# EAGLE schematic pov (EAGLE 6.1)
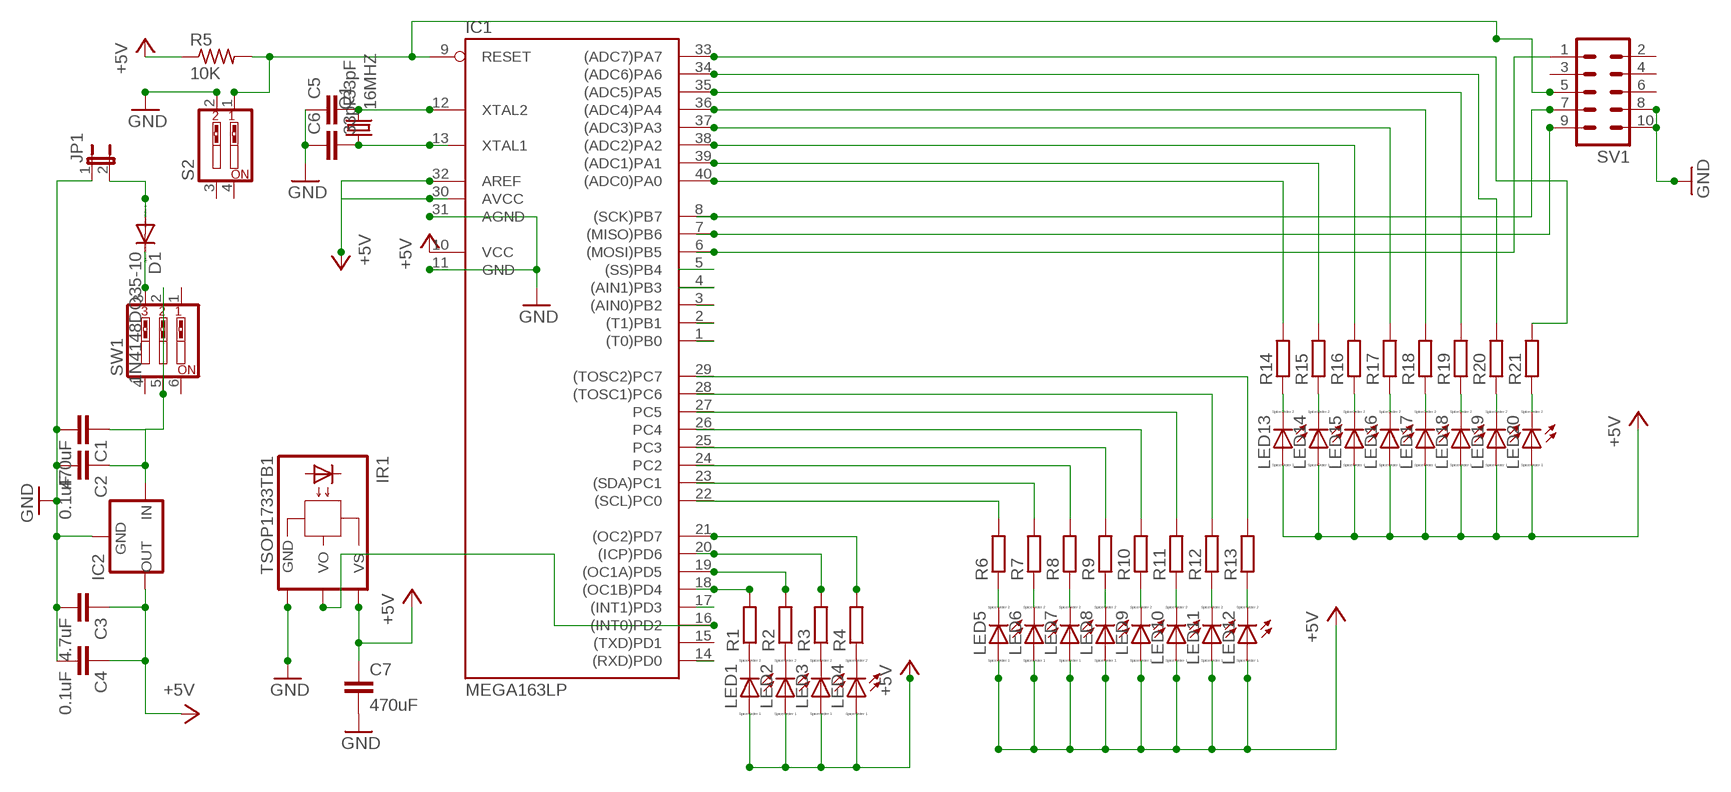
[diagram p0: schematic, sheet 1]

## Parts
C1  470uF  C2.5/4  [C2.5-4]
C2  0.1uF  C2.5/4  [C2.5-4]
C3  4.7uF  C2.5/4  [C2.5-4]
C4  0.1uF  C2.5/4  [C2.5-4]
C5  33pF  C2.5/4  [C2.5-4]
C6  33pF  C2.5/4  [C2.5-4]
C7  470uF  C2.5/4  [C2.5-4]
D1  1N4148DO35-10  [DO35-10]
IC1  MEGA163LP  [DIL40]
IC2  78XXS  [78XXS]
IR1  TSOP1733TB1  [TSOP17_TB1]
JP1  JP1E  [JP1]
LED1  LED_ELD260  [LED_LD260]
LED2  LED_ELD260  [LED_LD260]
LED3  LED_ELD260  [LED_LD260]
LED4  LED_ELD260  [LED_LD260]
LED5  LED_ELD260  [LED_LD260]
LED6  LED_ELD260  [LED_LD260]
LED7  LED_ELD260  [LED_LD260]
LED8  LED_ELD260  [LED_LD260]
LED9  LED_ELD260  [LED_LD260]
LED10  LED_ELD260  [LED_LD260]
LED11  LED_ELD260  [LED_LD260]
LED12  LED_ELD260  [LED_LD260]
LED13  LED_ELD260  [LED_LD260]
LED14  LED_ELD260  [LED_LD260]
LED15  LED_ELD260  [LED_LD260]
LED16  LED_ELD260  [LED_LD260]
LED17  LED_ELD260  [LED_LD260]
LED18  LED_ELD260  [LED_LD260]
LED19  LED_ELD260  [LED_LD260]
LED20  LED_ELD260  [LED_LD260]
Q1  16MHZ  CRYSTALHC49U-V  [HC49U-V]
R1  R-EU_0207/7  [0207/7]
R2  R-EU_0207/7  [0207/7]
R3  R-EU_0207/7  [0207/7]
R4  R-EU_0207/7  [0207/7]
R5  10K  R-US_0204/7  [0204/7]
R6  R-EU_0207/7  [0207/7]
R7  R-EU_0207/7  [0207/7]
R8  R-EU_0207/7  [0207/7]
R9  R-EU_0207/7  [0207/7]
R10  R-EU_0207/7  [0207/7]
R11  R-EU_0207/7  [0207/7]
R12  R-EU_0207/7  [0207/7]
R13  R-EU_0207/7  [0207/7]
R14  R-EU_0207/7  [0207/7]
R15  R-EU_0207/7  [0207/7]
R16  R-EU_0207/7  [0207/7]
R17  R-EU_0207/7  [0207/7]
R18  R-EU_0207/7  [0207/7]
R19  R-EU_0207/7  [0207/7]
R20  R-EU_0207/7  [0207/7]
R21  R-EU_0207/7  [0207/7]
S2  SW_DIP-2  [EDG-02]
SV1  MA05-2  [MA05-2]
SW1  SW_DIP-3  [EDG-03]

## Nets
+5V: C3.1 C4.1 C7.1 IC1.10(VCC) IC1.30(AVCC) IC1.32(AREF) IC2.OUT IR1.VS LED1.A LED2.A LED3.A LED4.A LED5.A LED6.A LED7.A LED8.A LED9.A LED10.A LED11.A LED12.A LED13.A LED14.A LED15.A LED16.A LED17.A LED18.A LED19.A LED20.A R5.1
GND: C1.2 C2.2 C3.2 C4.2 C5.1 C6.1 C7.2 IC1.11(GND) IC1.31(AGND) IC2.GND IR1.GND JP1.1 S2.2 SV1.8 SV1.10
N$1: D1.A JP1.2
N$2: LED12.K(C) R13.1
N$3: C5.2 IC1.12(XTAL2) Q1.2
N$4: C6.2 IC1.13(XTAL1) Q1.1
N$5: LED1.K(C) R1.1
N$6: IC1.9(RESET) R5.2 S2.1 SV1.5
N$7: IC1.22((SCL)PC0) R6.2
N$8: D1.C SW1.3
N$9: C1.1 C2.1 IC2.IN SW1.2 SW1.5
N$10: IC1.1((T0)PB0)
N$11: IC1.2((T1)PB1)
N$12: IC1.3((AIN0)PB2)
N$13: IC1.4((AIN1)PB3)
N$14: IC1.17((INT1)PD3)
N$16: IC1.5((SS)PB4)
N$17: IC1.28((TOSC1)PC6) R12.2
N$18: LED10.K(C) R11.1
N$19: IC1.26(PC4) R10.2
N$20: LED9.K(C) R10.1
N$21: IC1.25(PC3) R9.2
N$22: LED8.K(C) R9.1
N$23: LED7.K(C) R8.1
N$24: IC1.6((MOSI)PB5) SV1.1
N$25: IC1.7((MISO)PB6) SV1.9
N$26: IC1.8((SCK)PB7) SV1.7
N$27: IC1.14((RXD)PD0)
N$28: IC1.23((SDA)PC1) R7.2
N$29: IC1.33((ADC7)PA7) R21.2
N$30: IC1.34((ADC6)PA6) R20.2
N$31: IC1.35((ADC5)PA5) R19.2
N$32: IC1.36((ADC4)PA4) R18.2
N$33: IC1.37((ADC3)PA3) R17.2
N$34: IC1.38((ADC2)PA2) R16.2
N$35: IC1.39((ADC1)PA1) R15.2
N$36: IC1.40((ADC0)PA0) R14.2
N$37: IC1.24(PC2) R8.2
N$38: IC1.27(PC5) R11.2
N$39: IC1.29((TOSC2)PC7) R13.2
N$40: LED6.K(C) R7.1
N$41: LED20.K(C) R21.1
N$42: LED19.K(C) R20.1
N$43: LED18.K(C) R19.1
N$44: LED17.K(C) R18.1
N$45: LED15.K(C) R16.1
N$46: LED13.K(C) R14.1
N$47: LED16.K(C) R17.1
N$48: LED14.K(C) R15.1
N$49: LED5.K(C) R6.1
N$50: LED11.K(C) R12.1
N$51: LED2.K(C) R2.1
N$52: LED3.K(C) R3.1
N$53: LED4.K(C) R4.1
N$54: IC1.20((ICP)PD6) R3.2
N$55: IC1.21((OC2)PD7) R4.2
N$56: IC1.19((OC1A)PD5) R2.2
N$57: IC1.18((OC1B)PD4) R1.2
N$58: IC1.16((INT0)PD2) IR1.VO
Unconnected: IC1.15((TXD)PD1) S2.3 S2.4 SV1.2 SV1.3 SV1.4 SV1.6 SW1.1 SW1.4 SW1.6

## Library data of the parts
C1-C7 = capacitor-wima:C: CAPACITOR naming: grid - package width
D1 = diode:1N4148: DIODE high speed (Philips)
IC1 = atmel:MEGA163*P: MICROCONTROLLER 16 Kbytes FLASH 1 Kbytes EEPROM 1 Kbytes SRAM UART 8-channel 10 bit ADC hardware multiplier Source: avr.lbr; OC_FARNELL: unknown; OC_NEWARK: unknown
IC2 = v-reg:78XXS: VOLTAGE REGULATOR
IR1 = telefunken:TSOP17*TB1: TSOP17..TB1 IR Receiver Modules for Remote Control Systems Source: http://www.vishay.com/docs/82042/82042.pdf; OC_FARNELL: unknown; OC_NEWARK: unknown
JP1 = jumper:JP1E: JUMPER
LED1-LED20 = eagle-ltspice:LED_E: LED Source: http://www.osram.convergy.de Source: www.luxeon.com Source: www.kingbright.com; SPICEMODEL: NONE; SPICEPREFIX: D; SPICETYPE: diode
Q1 = crystal:CRYSTAL: CRYSTAL; OC_FARNELL: 1666969; OC_NEWARK: unknown
R1-R4 R6-R21 = rcl:R-EU_: RESISTOR, European symbol
R5 = resistor:R-US_: RESISTOR, American symbol
S2 = special:SW_DIP-2: DIP SWITCH
SV1 = con-lstb:MA05-2: PIN HEADER; OC_FARNELL: unknown; OC_NEWARK: unknown
SW1 = special:SW_DIP-3: DIP SWITCH